# Altium schematic sheet MotherBoard_PowerSupply_ebay.SchDoc
size A4; DocumentNumber: 6; SheetNumber: 6; SheetTotal: 9
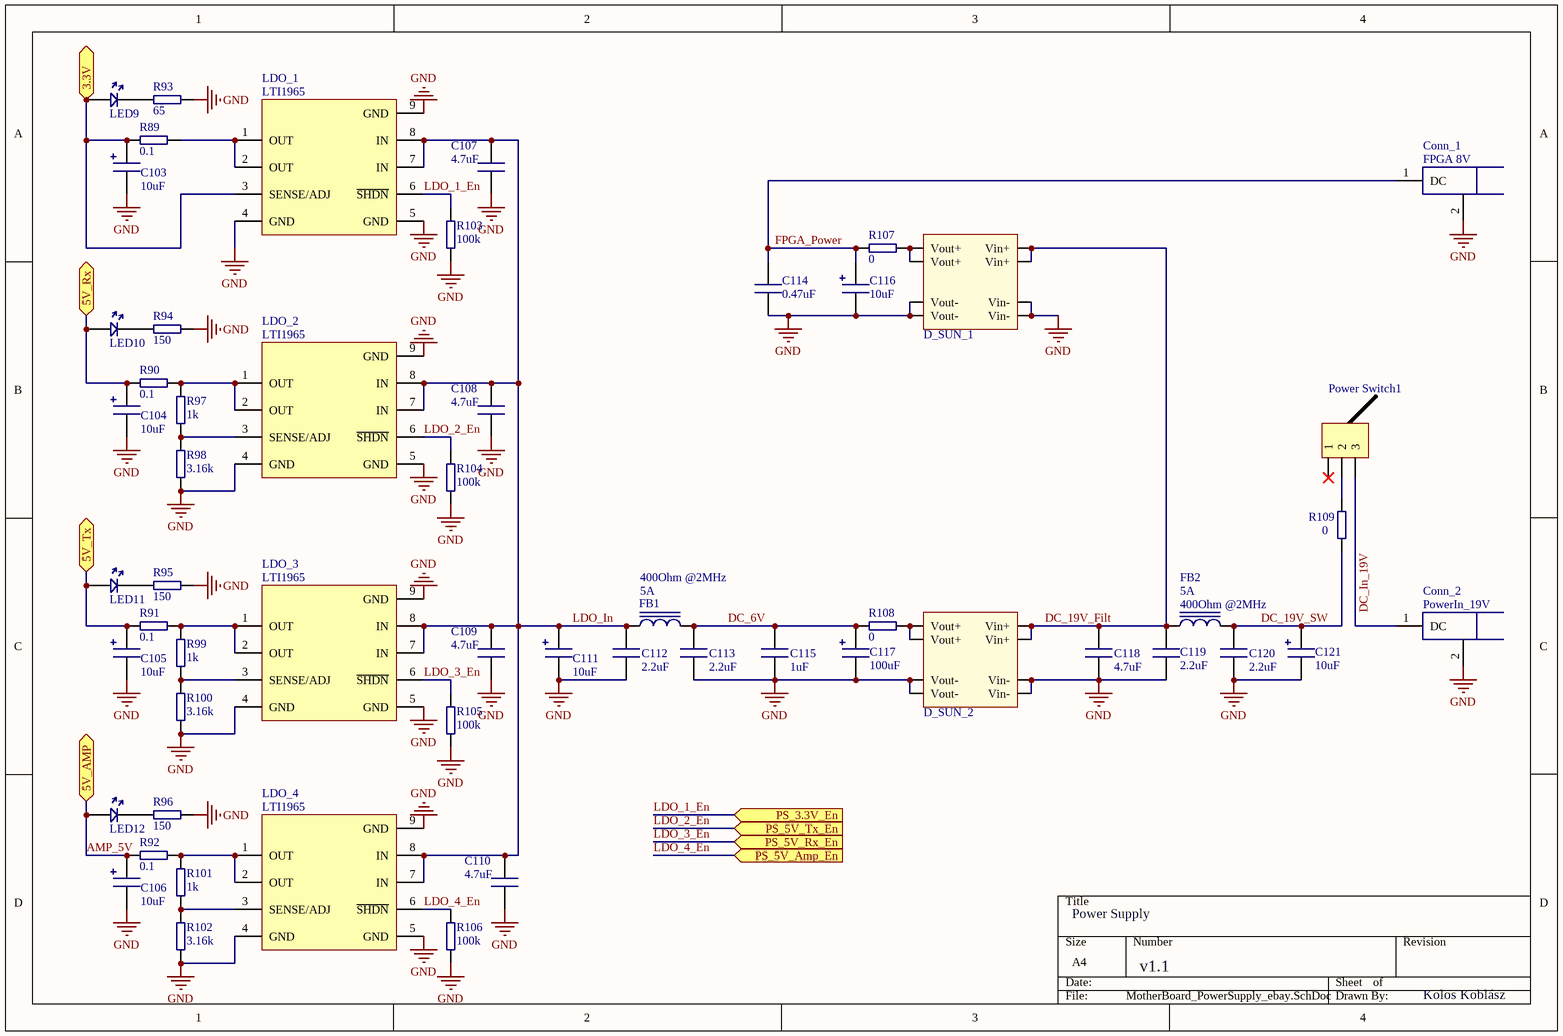
[diagram p0: MotherBoard_PowerSupply_ebay.SchDoc]

## Parts
C103  value 10uF  [ELKO_CAP]  (hidden comment: Cap2)
C104  value 10uF  [ELKO_CAP]  (hidden comment: Cap2)
C105  value 10uF  [ELKO_CAP]  (hidden comment: Cap2)
C106  value 10uF  [ELKO_CAP]  (hidden comment: Cap2)
C107  value 4.7uF  [0805 SMD Passive]  (hidden comment: Cap1)
C108  value 4.7uF  [0805 SMD Passive]  (hidden comment: Cap1)
C109  value 4.7uF  [0805 SMD Passive]  (hidden comment: Cap1)
C110  value 4.7uF  [0805 SMD Passive]  (hidden comment: Cap1)
C111  value 10uF  [ELKO_CAP]  (hidden comment: Cap2)
C112  value 2.2uF  [0805 SMD Passive]  (hidden comment: Cap1)
C113  value 2.2uF  [0805 SMD Passive]  (hidden comment: Cap1)
C114  value 0.47uF  [0805 SMD Passive]  (hidden comment: Cap1)
C115  value 1uF  [0805 SMD Passive]  (hidden comment: Cap1)
C116  value 10uF  [ELKO_CAP]  (hidden comment: Cap2)
C117  value 100uF  [ELKO_CAP]  (hidden comment: Cap2)
C118  value 4.7uF  [0805 SMD Passive]  (hidden comment: Cap1)
C119  value 2.2uF  [0805 SMD Passive]  (hidden comment: Cap1)
C120  value 2.2uF  [0805 SMD Passive]  (hidden comment: Cap1)
C121  value 10uF  [ELKO_CAP]  (hidden comment: Cap2)
Conn_1  FPGA 8V  [DC_Connector]
Conn_2  PowerIn_19V  [DC_Connector]
D_SUN_1  D_SUN  [D_SUN]  (value not drawn)
D_SUN_2  D_SUN  [D_SUN]  (value not drawn)
FB1  value 400Ohm @2MHz  MaxCurent: 5A  [FerritBead]  (hidden comment: Ferrit Bead)
FB2  value 400Ohm @2MHz  MaxCurent: 5A  [FerritBead]  (hidden comment: Ferrit Bead)
LDO_1  LTI1965  [LT1965]
LDO_2  LTI1965  [LT1965]
LDO_3  LTI1965  [LT1965]
LDO_4  LTI1965  [LT1965]
LED9  LED_Green  [0805 SMD Passive]  (value not drawn)
LED10  LED_Green  [0805 SMD Passive]  (value not drawn)
LED11  LED_Green  [0805 SMD Passive]  (value not drawn)
LED12  LED_Green  [0805 SMD Passive]  (value not drawn)
Power_Switch1  Switch  [Switch]  (value not drawn)
R89  value 0.1  [0805 SMD Passive]  (hidden comment: Resistor)
R90  value 0.1  [0805 SMD Passive]  (hidden comment: Resistor)
R91  value 0.1  [0805 SMD Passive]  (hidden comment: Resistor)
R92  value 0.1  [0805 SMD Passive]  (hidden comment: Resistor)
R93  value 65  [0805 SMD Passive]  (hidden comment: Resistor)
R94  value 150  [0805 SMD Passive]  (hidden comment: Resistor)
R95  value 150  [0805 SMD Passive]  (hidden comment: Resistor)
R96  value 150  [0805 SMD Passive]  (hidden comment: Resistor)
R97  value 1k  [0805 SMD Passive]  (hidden comment: Resistor)
R98  value 3.16k  [0805 SMD Passive]  (hidden comment: Resistor)
R99  value 1k  [0805 SMD Passive]  (hidden comment: Resistor)
R100  value 3.16k  [0805 SMD Passive]  (hidden comment: Resistor)
R101  value 1k  [0805 SMD Passive]  (hidden comment: Resistor)
R102  value 3.16k  [0805 SMD Passive]  (hidden comment: Resistor)
R103  value 100k  [0805 SMD Passive]  (hidden comment: Resistor)
R104  value 100k  [0805 SMD Passive]  (hidden comment: Resistor)
R105  value 100k  [0805 SMD Passive]  (hidden comment: Resistor)
R106  value 100k  [0805 SMD Passive]  (hidden comment: Resistor)
R107  value 0  [0805 SMD Passive]  (hidden comment: Resistor)
R108  value 0  [0805 SMD Passive]  (hidden comment: Resistor)
R109  value 0  [0805 SMD Passive]  (hidden comment: Resistor)

## Ports
3.3V, 5V_AMP, 5V_Rx, 5V_Tx, PS_3.3V_En, PS_5V_Amp_En, PS_5V_Rx_En, PS_5V_Tx_En

## Nets
GND: C103.2 C104.2 C105.2 C106.2 C107.1 C108.1 C109.1 C110.1 C111.2 C112.1 C113.1 C114.1 C115.2 C116.2 C117.2 C118.1 C119.1 C120.1 C121.2 Conn_1.2(GND) Conn_2.2(GND) D_SUN_1.1(Vin-) D_SUN_1.2(Vin-) D_SUN_1.7(Vout-) D_SUN_1.8(Vout-) D_SUN_2.1(Vin-) D_SUN_2.2(Vin-) D_SUN_2.7(Vout-) D_SUN_2.8(Vout-) LDO_1.4(GND) LDO_1.5(GND) LDO_1.9(GND) LDO_2.4(GND) LDO_2.5(GND) LDO_2.9(GND) LDO_3.4(GND) LDO_3.5(GND) LDO_3.9(GND) LDO_4.4(GND) LDO_4.5(GND) LDO_4.9(GND) R93.2 R94.2 R95.2 R96.2 R98.1 R100.1 R102.1 R103.1 R104.1 R105.1 R106.1
3.3V: C103.1 LDO_1.3(SENSE/ADJ) LED9.2(A) R89.1 ; port 3.3V
5V_Rx: C104.1 LED10.2(A) R90.1 ; port 5V_Rx
5V_Tx: C105.1 LED11.2(A) R91.1 ; port 5V_Tx
AMP_5V: C106.1 LED12.2(A) R92.1 ; port 5V_AMP
DC_6V: C113.2 C115.1 C117.1 FB1.2 R108.2
DC_19V_Filt: C118.2 C119.2 D_SUN_1.3(Vin+) D_SUN_1.4(Vin+) D_SUN_2.3(Vin+) D_SUN_2.4(Vin+) FB2.1
DC_19V_SW: C120.2 C121.1 FB2.2 R109.2
DC_In_19V: Conn_2.1(DC) Power_Switch1.3
FPGA_Power: C114.2 C116.1 Conn_1.1(DC) R107.2
LDO_1_En: LDO_1.6(~{SHDN}) R103.2 ; port PS_3.3V_En
LDO_2_En: LDO_2.6(~{SHDN}) R104.2 ; port PS_5V_Tx_En
LDO_3_En: LDO_3.6(~{SHDN}) R105.2 ; port PS_5V_Rx_En
LDO_4_En: LDO_4.6(~{SHDN}) R106.2 ; port PS_5V_Amp_En
LDO_In: C107.2 C108.2 C109.2 C110.2 C111.1 C112.2 FB1.1 LDO_1.7(IN) LDO_1.8(IN) LDO_2.7(IN) LDO_2.8(IN) LDO_3.7(IN) LDO_3.8(IN) LDO_4.7(IN) LDO_4.8(IN)
NetD_SUN_1_5: D_SUN_1.5(Vout+) D_SUN_1.6(Vout+) R107.1
NetD_SUN_2_5: D_SUN_2.5(Vout+) D_SUN_2.6(Vout+) R108.1
NetLDO_1_1: LDO_1.1(OUT) LDO_1.2(OUT) R89.2
NetLDO_2_1: LDO_2.1(OUT) LDO_2.2(OUT) R90.2 R97.2
NetLDO_2_3: LDO_2.3(SENSE/ADJ) R97.1 R98.2
NetLDO_3_1: LDO_3.1(OUT) LDO_3.2(OUT) R91.2 R99.2
NetLDO_3_3: LDO_3.3(SENSE/ADJ) R99.1 R100.2
NetLDO_4_1: LDO_4.1(OUT) LDO_4.2(OUT) R92.2 R101.2
NetLDO_4_3: LDO_4.3(SENSE/ADJ) R101.1 R102.2
NetLED9_1: LED9.1(K) R93.1
NetLED10_1: LED10.1(K) R94.1
NetLED11_1: LED11.1(K) R95.1
NetLED12_1: LED12.1(K) R96.1
NetPower_Switch1_2: Power_Switch1.2 R109.1

Not connected (* = marked no-connect by the designer): Power_Switch1 1*

## Notes on the sheet
- Power Supply
- v1.1
- Kolos Koblász

## Library data of the parts
C103-C106 C111 C116 C117 C121 = Cap2: SMD Polarized Capacitor; Precision: 20%; MaxVolt: 16V; FootPrint: *
C107-C110 C112-C115 C118-C120 = Cap1: SMD Capacitor; Precision: 5%; MaxVolt: 16V; FootPrint: *
Conn_1 Conn_2 = DC_Connector: Coaxial DC connector - female; Manufacturer: *; Size: *; Vmax: *; Imax: *
D_SUN_1 D_SUN_2 = D_SUN: 3A DC Buck Step down Adjustable Converter Module 5-28V to 3-20V; Manufacturer: elec modul 58; Vin: 5V - 28V; Distributor: e-bay; Vout: 3-20V
FB1 FB2 = FerritBead: PartNumber: FB20022-4B-RC; Precision: 10%; FootPrint: THD; Digi Key Order Code: FB20022-4B-RC-ND
LDO_1 = LTI1965: Low Dropout Linear Regulator; Manufacturer: Analog Devices; Order Code: LT1965EDD-3.3#PBF; Package Description: 8-Lead Plastic DFN; PartNumber: LTI1965; Version: Fix 3.3V
LDO_2-LDO_4 = LTI1965: Low Dropout Linear Regulator; Manufacturer: Analog Devices; Order Code: LT1965EDD#PBF; Package Description: 8-Lead Plastic DFN; PartNumber: LTI1965; Version: Adjustable
LED9-LED12 = LED_Green: Diode; Manufacturer: LITEON; Partnumber: LTST-C171KGKT; Type: Green; MaxForwardCurrent: 30mA; MaxRevVoltage: 5V; ForwardCurrent: 20mA; ForwardVoltage: 2V; OrderCode: 160-1426-1-ND; Footprint: 0805
Power_Switch1 = Switch: 3 state switch; PinNumber: 3; Pitch: 2.54mm; Type: THD 3 state; Digi Key Order Code: EG2355-ND
R89-R109 = Res1: SMD Resistor; Precision: 1%; MaxPower: 0.1W; FootPrint: SMD